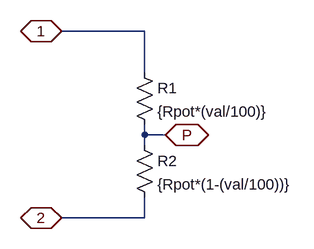
[diagram p0: schematic potential_divider.asc]
potential_divider.asc, the LTspice schematic file:
Version 4
SHEET 1 880 680
WIRE 304 96 176 96
WIRE 304 160 304 96
WIRE 304 256 304 240
WIRE 336 256 304 256
WIRE 304 272 304 256
WIRE 304 384 304 352
WIRE 304 384 176 384
FLAG 176 96 1
IOPIN 176 96 BiDir
FLAG 176 384 2
IOPIN 176 384 BiDir
FLAG 336 256 P
IOPIN 336 256 BiDir
SYMBOL Res 288 144 R0
SYMATTR InstName R1
SYMATTR Value {Rpot*(val/100)}
SYMBOL Res 288 256 R0
SYMATTR InstName R2
SYMATTR Value {Rpot*(1-(val/100))}

The netlist it stands for:
* potential_divider.asc
R1 1 P {Rpot*(val/100)}
R2 P 2 {Rpot*(1-(val/100))}
.backanno
.end